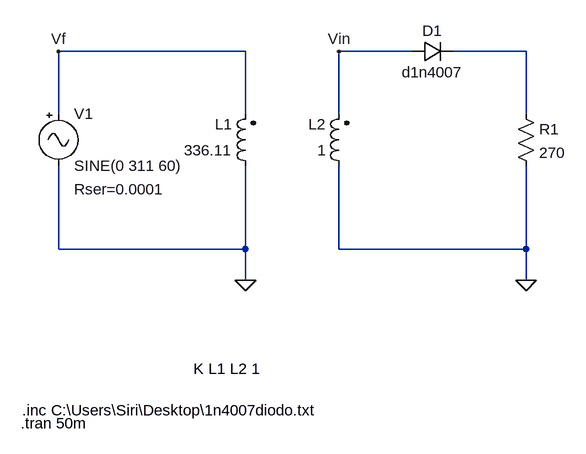
[diagram p0: schematic SimulacaoRelatorio2Parte1.asc]
SimulacaoRelatorio2Parte1.asc, the LTspice schematic file:
Version 4
SHEET 1 900 680
WIRE 400 -160 112 -160
WIRE 656 -160 544 -160
WIRE 832 -160 720 -160
WIRE 112 -64 112 -160
WIRE 400 -64 400 -160
WIRE 544 -64 544 -160
WIRE 832 -64 832 -160
WIRE 112 144 112 16
WIRE 400 144 400 16
WIRE 400 144 112 144
WIRE 544 144 544 16
WIRE 832 144 832 16
WIRE 832 144 544 144
WIRE 400 192 400 144
WIRE 832 192 832 144
FLAG 400 192 0
FLAG 832 192 0
FLAG 544 -160 Vin
FLAG 112 -160 Vf
SYMBOL Misc\\signal 112 -80 R0
WINDOW 123 0 0 Left 0
WINDOW 39 24 132 Left 2
SYMATTR InstName V1
SYMATTR Value SINE(0 311 60)
SYMATTR SpiceLine Rser=0.0001
SYMBOL ind2 416 32 R180
WINDOW 0 36 80 Left 2
WINDOW 3 36 40 Left 2
SYMATTR InstName L1
SYMATTR Value 336.11
SYMATTR Type ind
SYMBOL ind2 560 32 R180
WINDOW 0 36 80 Left 2
WINDOW 3 36 40 Left 2
SYMATTR InstName L2
SYMATTR Value 1
SYMATTR Type ind
SYMBOL res 816 -80 R0
SYMATTR InstName R1
SYMATTR Value 270
SYMBOL diode 656 -144 R270
WINDOW 0 32 32 VTop 2
WINDOW 3 0 32 VBottom 2
SYMATTR InstName D1
SYMATTR Value d1n4007
TEXT 56 392 Left 2 !.inc C:\\Users\\Siri\\Desktop\\1n4007diodo.txt
TEXT 320 328 Left 2 !K L1 L2 1
TEXT 54 412 Left 2 !.tran 50m

The netlist it stands for:
* SimulacaoRelatorio2Parte1.asc
V1 Vf 0 SINE(0 311 60) Rser=0.0001
L1 0 Vf 336.11
L2 0 Vin 1
R1 N001 0 270
D1 Vin N001 d1n4007
.model D D
.lib standard.dio
.inc C:\Users\Siri\Desktop\1n4007diodo.txt
K L1 L2 1
.tran 50m
.backanno
.end